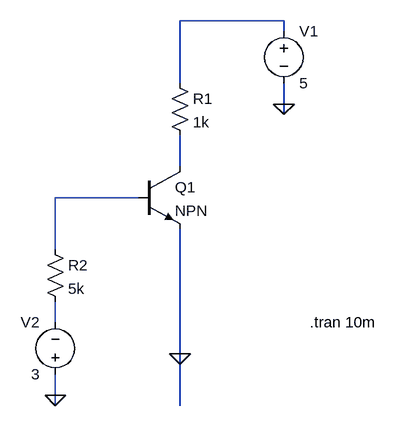
[diagram p0: schematic Draft9.asc]
Draft9.asc, the LTspice schematic file:
Version 4
SHEET 1 880 680
WIRE 544 64 384 64
WIRE 544 80 544 64
WIRE 384 160 384 64
WIRE 544 192 544 160
WIRE 544 208 544 192
WIRE 384 288 384 240
WIRE 320 336 192 336
WIRE 192 416 192 336
WIRE 192 528 192 496
WIRE 384 576 384 384
WIRE 192 640 192 608
WIRE 192 656 192 640
WIRE 384 656 384 576
FLAG 384 576 0
FLAG 192 640 0
FLAG 544 192 0
SYMBOL npn 320 288 R0
SYMATTR InstName Q1
SYMBOL res 368 144 R0
SYMATTR InstName R1
SYMATTR Value 1k
SYMBOL res 176 400 R0
SYMATTR InstName R2
SYMATTR Value 5k
SYMBOL voltage 544 64 R0
SYMATTR InstName V1
SYMATTR Value 5
SYMBOL voltage 192 624 R180
WINDOW 0 24 96 Left 2
WINDOW 3 24 16 Left 2
SYMATTR InstName V2
SYMATTR Value 3
TEXT 584 528 Left 2 !.tran 10m

The netlist it stands for:
* Draft9.asc
Q1 N002 N003 0 0 NPN
R1 N001 N002 1k
R2 N003 N004 5k
V1 N001 0 5
V2 0 N004 3
.model NPN NPN
.model PNP PNP
.lib standard.bjt
.tran 10m
.backanno
.end